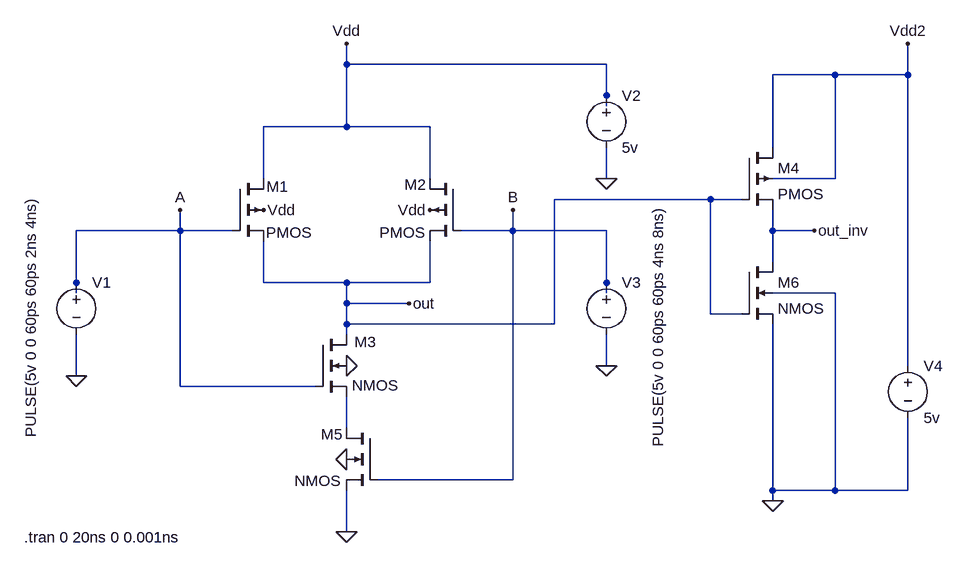
[diagram p0: schematic AND.asc]
AND.asc, the LTspice schematic file:
Version 4
SHEET 1 1256 740
WIRE 160 -64 160 -96
WIRE 560 -64 160 -64
WIRE 912 -48 816 -48
WIRE 1024 -48 1024 -96
WIRE 1024 -48 912 -48
WIRE 560 -16 560 -64
WIRE 560 0 560 -16
WIRE 160 32 160 -64
WIRE 160 32 32 32
WIRE 288 32 160 32
WIRE 816 64 816 -48
WIRE 32 112 32 32
WIRE 288 112 288 32
WIRE 560 112 560 64
WIRE 912 112 912 -48
WIRE 912 112 816 112
WIRE 720 144 480 144
WIRE 768 144 720 144
WIRE -96 192 -96 160
WIRE -96 192 -256 192
WIRE -16 192 -96 192
WIRE 416 192 416 160
WIRE 416 192 336 192
WIRE 560 192 416 192
WIRE 816 192 816 160
WIRE 880 192 816 192
WIRE 816 240 816 192
WIRE -256 272 -256 192
WIRE 32 272 32 208
WIRE 160 272 32 272
WIRE 288 272 288 208
WIRE 288 272 160 272
WIRE 560 272 560 192
WIRE -256 288 -256 272
WIRE 560 288 560 272
WIRE 912 288 816 288
WIRE 160 304 160 272
WIRE 256 304 160 304
WIRE 720 320 720 144
WIRE 768 320 720 320
WIRE 160 336 160 304
WIRE 480 336 480 144
WIRE 480 336 160 336
WIRE 160 352 160 336
WIRE 560 400 560 352
WIRE 1024 400 1024 -48
WIRE -256 416 -256 352
WIRE -96 432 -96 192
WIRE 112 432 -96 432
WIRE 160 496 160 448
WIRE 416 576 416 192
WIRE 416 576 208 576
WIRE 816 592 816 336
WIRE 912 592 912 288
WIRE 912 592 816 592
WIRE 1024 592 1024 480
WIRE 1024 592 912 592
WIRE 816 608 816 592
WIRE 160 656 160 592
FLAG 160 656 0
FLAG 560 400 0
FLAG -256 416 0
FLAG 160 -96 Vdd
FLAG 32 160 Vdd
FLAG 288 160 Vdd
FLAG -96 160 A
FLAG 416 160 B
FLAG 560 112 0
FLAG 160 400 0
FLAG 160 544 0
FLAG 816 608 0
FLAG 1024 -96 Vdd2
FLAG 880 192 out_inv
FLAG 256 304 out
SYMBOL voltage -256 256 R0
WINDOW 3 -70 -116 VRight 2
WINDOW 123 0 0 Left 0
WINDOW 39 0 0 Left 0
SYMATTR Value PULSE(5v 0 0 60ps 60ps 2ns 4ns)
SYMATTR InstName V1
SYMBOL pmos4 -16 112 R0
WINDOW 0 53 12 Left 2
WINDOW 3 52 83 Left 2
SYMATTR InstName M1
SYMATTR Value2 l=0.6u w=6u
SYMBOL pmos4 336 112 M0
WINDOW 0 53 9 Left 2
WINDOW 3 55 83 Left 2
SYMATTR InstName M2
SYMATTR Value2 l=0.6u w=6u
SYMBOL nmos4 112 352 R0
WINDOW 0 60 11 Left 2
WINDOW 3 56 78 Left 2
SYMATTR InstName M3
SYMATTR Value2 l=0.6u w=3u
SYMBOL nmos4 208 496 M0
WINDOW 0 54 10 Left 2
WINDOW 3 56 81 Left 2
SYMATTR InstName M5
SYMATTR Value2 l=0.6u w=3u
SYMBOL voltage 560 -32 R0
WINDOW 123 0 0 Left 0
WINDOW 39 0 0 Left 0
SYMATTR InstName V2
SYMATTR Value 5v
SYMBOL voltage 560 256 R0
WINDOW 3 79 -101 VRight 2
WINDOW 123 0 0 Left 0
WINDOW 39 0 0 Left 0
SYMATTR Value PULSE(5v 0 0 60ps 60ps 4ns 8ns)
SYMATTR InstName V3
SYMBOL pmos4 768 64 R0
SYMATTR InstName M4
SYMATTR Value2 l=0.6u w=6u
SYMBOL nmos4 768 240 R0
SYMATTR InstName M6
SYMATTR Value2 l=0.6u w=3u
SYMBOL voltage 1024 384 R0
WINDOW 123 0 0 Left 0
WINDOW 39 0 0 Left 0
SYMATTR InstName V4
SYMATTR Value 5v
TEXT -336 664 Left 2 !.tran 0 20ns 0 0.001ns

The netlist it stands for:
* AND.asc
V1 A 0 PULSE(5v 0 0 60ps 60ps 2ns 4ns)
M1 Vdd A out Vdd PMOS l=0.6u w=6u
M2 Vdd B out Vdd PMOS l=0.6u w=6u
M3 out A N001 0 NMOS l=0.6u w=3u
M5 N001 B 0 0 NMOS l=0.6u w=3u
V2 Vdd 0 5v
V3 B 0 PULSE(5v 0 0 60ps 60ps 4ns 8ns)
M4 Vdd2 out out_inv Vdd2 PMOS l=0.6u w=6u
M6 out_inv out 0 0 NMOS l=0.6u w=3u
V4 Vdd2 0 5v
.model NMOS NMOS
.model PMOS PMOS
.lib standard.mos
.tran 0 20ns 0 0.001ns
.backanno
.end